# Altium schematic sheet GC-Sch2.SchDoc (part 3 of 3)
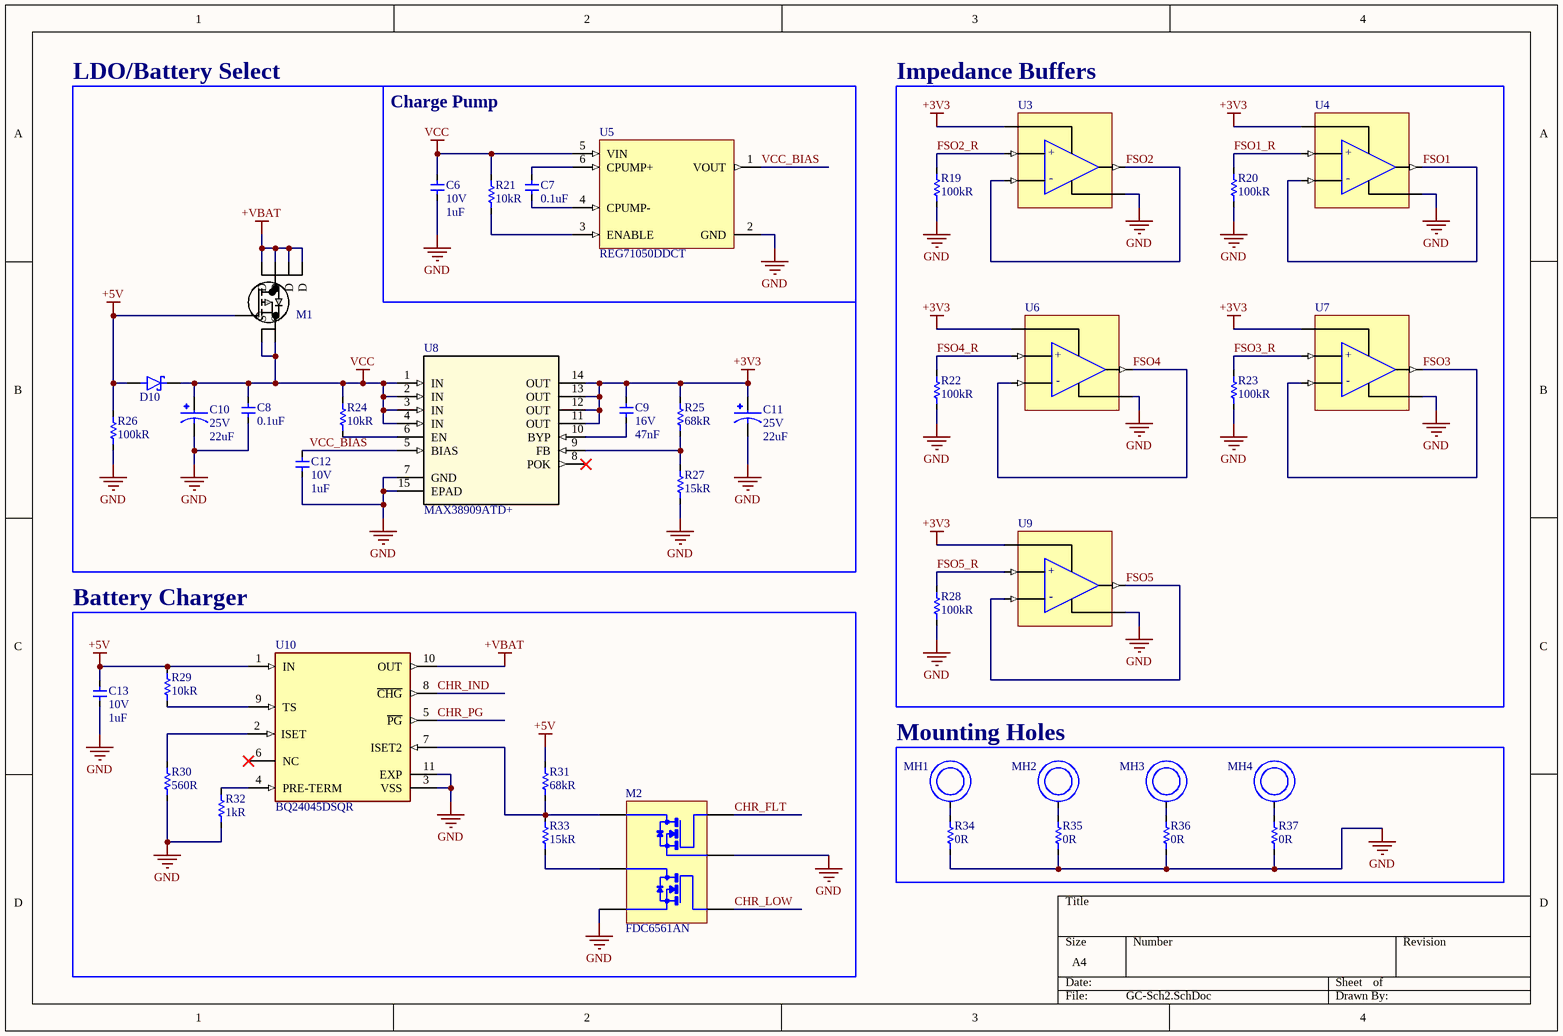
[diagram p2: GC-Sch2.SchDoc]

## Library data of the parts (continued)
U5 = U-REG71050DDC: Switched Capacitor Converter, 0.06A, 1000kHz Switching Freq-Max, PDSO6; Manufacturer: Texas Instruments; Package Body Material: Plastic; Max Input Voltage: 5.5V; Min Input Voltage: 2.7V; Number of Functions: 1; Nominal Input Voltage: 3.25V; Nominal Output Voltage: 5V; Package Equivalence Code: TSOP6,.11,37; Switcher Configuration: DOUBLER INVERTER; Switching Frequency-Max: 1MHz; Qualification Status: Not Qualified; Supplier 1: Mouser; Supplier Part Number 1: 595-REG71050DDCT; Manufacturer Part Number: REG71050DDCT; RoHS: Yes; Category: Voltage Regulators - Switching; Stock: 228; Pricing: 1=1.6, 10=1.39, 50=1.39, 100=1.16, 1000=0.805, 10000=0.694 (USD); Package Code: TSSOP; Number of Pins: 6; Package Shape: Rectangular; Terminal Finish: Nickel; Min Operating Temperature: -40°C; Max Operating Temperature: 85°C; JESD-609 Code: e4; JESD-30 Code: R-PDSO-G6; Moisture Sensitivity Level: 1; Package Style: SMALL OUTLINE, THIN PROFILE, SHRINK PITCHMeter; Peak Reflow Temperature (Cel): 260°C; Surface Mount: Yes; Terminal Form: Gull Wing; Terminal Position: DUAL; Analog IC - Other Type: SWITCHED CAPACITOR CONVERTER; Length: 2.9mm; Width: 1.6mm; Height - Seated (Max): 1.1mm; Terminal Pitch: 0.95mm; Reach SVHC Compliant: Yes; RoHS Compliant: Yes; Temperature Grade: INDUSTRIAL; ComponentLink1URL: https://www.ti.com:443/lit/ds/symlink/reg710-25.pdf?src-supplier=IHS+Markit; ComponentLink1Description: https://www.ti.com:443/lit/ds/symlink/reg710-25.pdf?src-supplier=IHS+Markit; ComponentLink2URL: https://datasheet.ciiva.com/22669/1716593-22669509.pdf?src-supplier=Element14; ComponentLink2Description: https://datasheet.ciiva.com/22669/1716593-22669509.pdf?src-supplier=Element14; ComponentLink3URL: https://datasheet.ciiva.com/15114/getdatasheetpartid-294612-15114101.pdf?src-supplier=Verical; ComponentLink3Description: https://datasheet.ciiva.com/15114/getdatasheetpartid-294612-15114101.pdf?src-supplier=Verical; ComponentLink4URL: https://datasheet.ciiva.com/41462/001014487-da-01-en-ic-reg-multi-c-reg71050ddct-sot-23-6-tid-41462341.pdf?src-supplier=Conrad; ComponentLink4Description: https://datasheet.ciiva.com/41462/001014487-da-01-en-ic-reg-multi-c-reg71050ddct-sot-23-6-tid-41462341.pdf?src-supplier=Conrad; ComponentLink5URL: https://datasheet.ciiva.com/2029/reg71050-2029349.pdf?src-supplier=Digikey; ComponentLink5Description: https://datasheet.ciiva.com/2029/reg71050-2029349.pdf?src-supplier=Digikey; ComponentLink6URL: https://datasheet.ciiva.com/2029/reg71050-2029348.pdf?src-supplier=Digikey; ComponentLink6Description: https://datasheet.ciiva.com/2029/reg71050-2029348.pdf?src-supplier=Digikey; ComponentLink7URL: https://datasheet.ciiva.com/2029/reg71050-2029350.pdf?src-supplier=Digikey; ComponentLink7Description: https://datasheet.ciiva.com/2029/reg71050-2029350.pdf?src-supplier=Digikey; ComponentLink8URL: https://datasheet.ciiva.com/3216/reg71050-3216238.pdf?src-supplier=Avnet; ComponentLink8Description: https://datasheet.ciiva.com/3216/reg71050-3216238.pdf?src-supplier=Avnet
U8 = U-MAX38909ATD+: IC Reg Lin Pos Prog 4A 14TDFN; Manufacturer: Analog Devices; Supplier 1: Mouser; Supplier Part Number 1: 700-MAX38909ATD+; Manufacturer Part Number: MAX38909ATD+; RoHS: No; Stock: 2276; Pricing: 1=5.13, 10=3.89, 50=3.89, 100=3.69, 1000=3.05, 10000=3.05 (USD)
U10 = U-BQ24045DSQR: Power Supply Support Circuit, Adjustable, 1 Channel, 6.65, PDSO10; Manufacturer: Texas Instruments; Package Body Material: Plastic; Adjustable Threshold: Yes; Number of Channels: 1; Power Supplies: 5V; Supply Current-Max (Isup): 1A; Supply Voltage-Max (Vsup): 28V; Supply Voltage-Min (Vsup): 3.5V; Qualification Status: Not Qualified; Supplier 1: Mouser; Supplier Part Number 1: 595-BQ24045DSQR; Manufacturer Part Number: BQ24045DSQR; RoHS: Yes; Category: Battery Management; Stock: 6811; Pricing: 1=1.05, 10=0.926, 50=0.926, 100=0.768, 1000=0.563, 10000=0.452 (USD); Package Code: HVSON; Number of Pins: 10; Package Shape: Square; Terminal Finish: Nickel; JESD-609 Code: e4; Analog IC - Other Type: POWER SUPPLY SUPPORT CIRCUIT; JESD-30 Code: S-PDSO-N10; Moisture Sensitivity Level: 2; Number of Functions: 1; Package Style: SMALL OUTLINE, HEAT SINK/SLUG, VERY THIN PROFILEMeter; Peak Reflow Temperature (Cel): 260°C; Supply Voltage-Nom (Vsup): 5V; Surface Mount: Yes; Terminal Form: No Lead; Terminal Position: DUAL; Length: 2mm; Width: 2mm; Height - Seated (Max): 0.8mm; Terminal Pitch: 0.4mm; Reach SVHC Compliant: Yes; RoHS Compliant: Yes; ComponentLink1URL: https://www.ti.com:443/lit/ds/symlink/bq24040.pdf?src-supplier=IHS+Markit; ComponentLink1Description: https://www.ti.com:443/lit/ds/symlink/bq24040.pdf?src-supplier=IHS+Markit; ComponentLink2URL: https://datasheet.ciiva.com/15367/slus941e-317338-15367177.pdf?src-supplier=Mouser; ComponentLink2Description: https://datasheet.ciiva.com/15367/slus941e-317338-15367177.pdf?src-supplier=Mouser; ComponentLink3URL: https://datasheet.ciiva.com/15047/bq24045-15047702.pdf?src-supplier=Digikey; ComponentLink3Description: https://datasheet.ciiva.com/15047/bq24045-15047702.pdf?src-supplier=Digikey

## Notes on the sheet
- (in symbol U-MCP6071T-E/OT) +; -